# EAGLE design SmellSprayer (EAGLE 8.2.1)
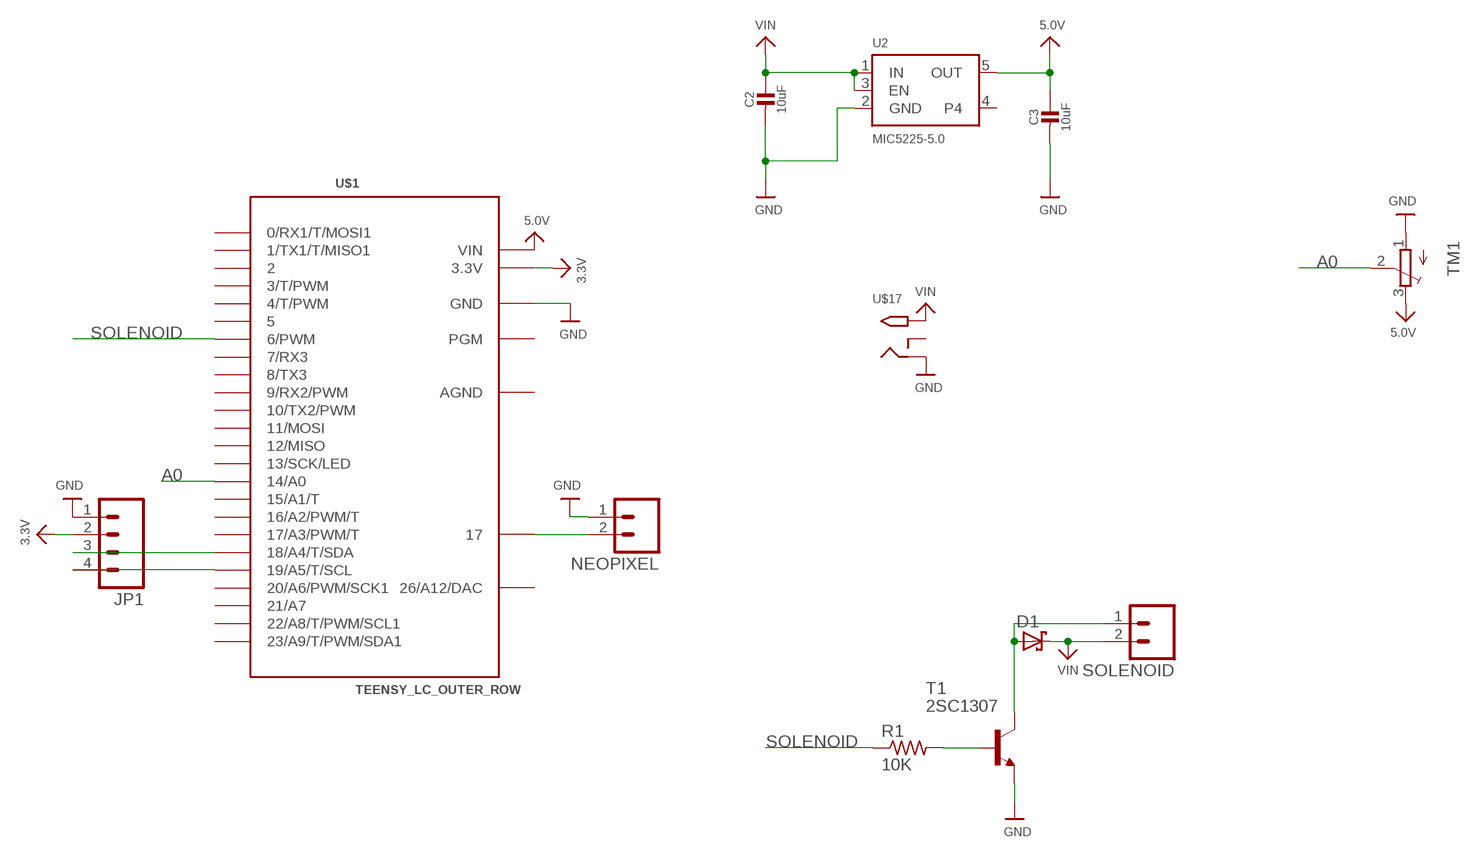
[diagram p0: schematic, sheet 1]

## Parts
C2  10uF  CAP_CERAMIC0805-NOOUTLINE  [0805-NO]
C3  10uF  CAP_CERAMIC0805-NOOUTLINE  [0805-NO]
D1  SCHOTTKY-DIODEDO41-7  [DO41-7]
JP1  M04POLAR  [MOLEX-1X4]
NEOPIXEL  M02POLAR  [MOLEX-1X2]
R1  10K  R-US_R0805  [R0805]
SOLENOID  M023.5MM_LOCK  [SCREWTERMINAL-3.5MM-2_LOCK]
T1  2SC1307  [TO220AV]
TM1  TRIMPOT3386  [TRIM-3386]
U2  MIC5225-5.0  VREG_SOT23-5  [SOT23-5]
U$1  TEENSY_LC_OUTER_ROW  [TEENSY3-OUTER_ROW]
U$17  2.1MMJACKSMT  [DCJACK_2MM_SMT]

## Nets
3.3V: JP1.2 U$1.3.3V U$1.3.3V1(3.3V)
5.0V: C3.1 TM1.3(E) U2.5(OUT) U$1.VIN
A0: TM1.2(S) U$1.14/A0
GND: C2.2 C3.2 JP1.1 NEOPIXEL.1 T1.3(E) TM1.1(A) U2.2(GND) U$1.GND U$1.GND1(GND) U$17.GND(RING)
N$1: D1.A SOLENOID.1 T1.2(C)
N$2: R1.2 T1.1(B)
N$4: NEOPIXEL.2 U$1.VBAT
SCL: JP1.4 U$1.19/A5(19/A5/T/SCL)
SDA: JP1.3 U$1.18/A4(18/A4/T/SDA)
SOLENOID: R1.1 U$1.6(6/PWM)
VIN: C2.1 D1.C SOLENOID.2 U2.1(IN) U2.3(EN) U$17.PWR2(TIP)
Unconnected: U2.4 U$1.0(0/RX1/T/MOSI1) U$1.1(1/TX1/T/MISO1) U$1.2 U$1.3(3/T/PWM) U$1.4(4/T/PWM) U$1.5 U$1.7(7/RX3) U$1.8(8/TX3) U$1.9(9/RX2/PWM) U$1.10(10/TX2/PWM) U$1.11(11/MOSI) U$1.12(12/MISO) U$1.13(13/SCK/LED) U$1.15/A1(15/A1/T) U$1.16/A2(16/A2/PWM/T) U$1.17/A3(17/A3/PWM/T) U$1.20/A6(20/A6/PWM/SCK1) U$1.21/A7 U$1.22/A8(22/A8/T/PWM/SCL1) U$1.23/A9(23/A9/T/PWM/SDA1) U$1.PGM U$17.GNDBREAK(RING_SW)

## Power pins joined to a net without a drawn wire
26/A12/DAC: U$1.RESET/DAC(26/A12/DAC)
AGND: U$1.AGND

## Library data of the parts
C2 C3 = microbuilder:CAP_CERAMIC: Ceramic Capacitors For new designs, use the packages preceded by an '_' character since they are more reliable: The following footprints should be used on most boards: _0402 - Standard footprint for regular board layouts _0603 - Standard footprint for regular board layouts _0805 - Standard footprint for regular board layouts _1206 - Standard footprint for regular board layouts For extremely tight-pitch boards where space is at a premium, the following 'micro-pitch' footprints can be used (smaller pads, no silkscreen outline, etc.): _0402MP - Micro-pitch footprint for very dense/compact boards _0603MP - Micro-pitch footprint for very dense/compact boards _0805MP - Micro-pitch footprint for very dense/compact boards _1206MP - Micro-pitch footprint for very dense/compact boards
D1 = adafruit:SCHOTTKY-DIODE: Schottky Diode
JP1 = SparkFun-Connectors:M04: Header 4 Standard 4-pin 0.1" header. Use with straight break away headers (SKU : PRT-00116), right angle break away headers (PRT-00553), swiss pins (PRT-00743), machine pins (PRT-00117), and female headers (PRT-00115). Molex polarized connector foot print use with SKU : PRT-08231 with associated crimp pins and housings. 1MM SMD Version SKU: PRT-10208
NEOPIXEL = SparkFun-Connectors:M02: Standard 2-pin 0.1" header. Use with - straight break away headers ( PRT-00116) - right angle break away headers (PRT-00553) - swiss pins (PRT-00743) - machine pins (PRT-00117) - female headers (PRT-00115) Molex polarized connector foot print use with: PRT-08233 with associated crimp pins and housings. 2.54_SCREWTERM for use with PRT-10571. 3.5mm Screw Terminal footprints for PRT-08084 5mm Screw Terminal footprints for use with PRT-08432
R1 = adafruit:R-US_: RESISTOR, American symbol
SOLENOID = SparkFun-Connectors:M02: Standard 2-pin 0.1" header. Use with - straight break away headers ( PRT-00116) - right angle break away headers (PRT-00553) - swiss pins (PRT-00743) - machine pins (PRT-00117) - female headers (PRT-00115) Molex polarized connector foot print use with: PRT-08233 with associated crimp pins and housings. 2.54_SCREWTERM for use with PRT-10571. 3.5mm Screw Terminal footprints for PRT-08084 5mm Screw Terminal footprints for use with PRT-08432; PROD_ID: CONN-08399
T1 = transistor:2SC1307: NPN Transistor Silicon Epitaxial, High Frequency Power Amplifier Source: 2SC1307.pdf
TM1 = adafruit:TRIMPOT: SMT trimmer potentiometer part number TC33X http://www.ladyada.net/library/eagle
U2 = microbuilder:VREG_SOT23-5: SOT23-5 Fixed Voltage Regulators Part Current Out V Out V In V Dropout θJA (°C/W) TJ (°C) Digikey Part No. ADP121 150mA 3.3V 3.4-5.5V 0.09V @ 150mA -- -- ADP121-AUJZ33R7CT-ND ADP121 150mA 3.0V 3.1-5.5V 0.09V @ 150mA -- -- ADP121-AUJZ30R7CT-ND ADP122 300mA 3.3V 3.4-5.5V 0.085V @ 300mA -- -- ADP122AUJZ-3.3-R7CT-ND ADP1712 300mA 3.3V 3.5-5.5V 0.17V @ 300mA -- -- ADP1712AUJZ-3.3-R7TR-ND AP7311 (Low Cost) 150mA 3.3V 3.5-6V 0.15V @ 150mA -- -- AP7311-33WG-7DICT-ND LD39015M18R 150mA 1.8V 1.9V-5.5V 0.08V @ 100mA -- -- 497-6977-1-ND LP2985A-33DBVR 150mA 3.3V 3.3-16V 0.28V @ 150mA 206 150 296-18479-1-ND MCP1824T-3302E/OT 300mA 3.3V 3.5V-6V 0.2V @ 300mA -- -- MCP1824T-3302E/OTCT-ND MIC5205-2.5YM5 TR 150mA 2.5V 2.7-16V 0.165V @ 150mA -- -- 576-1257-2-ND MIC5205-3.0YM5 TR 150mA 3.0V 3.2V-16V 0.165V @ 150mA -- -- 576-1258-2-ND MIC5205-3.3YM5 TR 150mA 3.3V 3.5V-16V 0.165V @ 150mA -- -- 576-1259-2-ND TPS780330220 150mA 3.3V+2.2V 3.6-5.5V 250mV Max -- -- 296-23332-1-ND TDA3663/N1,135 100mA 3.3V 3.5-45V 0.18V @ 50mA -- -- 568-5343-1-ND Max operating temp can be calculated using θJA, TJ (max junction temperature), and power in watts. Set the "Maximum Ambient Temperature" until it reaches TJ ("Max Junction Temperature"), which is the absolute limit for safe use of the regulator: Heat Sink Temperature Calculator <http://www.daycounter.com/Calculators/Heat-Sink-Temperature-Calculator.phtml> For example, With 12V source into a 3.3V LP2985 and a 30mA load, we are dissipating (12V-3.3V) * 0.03A = 0.261W. With a θJA of 206 °C/W, a TJ of 150°C, and 261mW we can safely use the chip without a heat sink up to 75°C (=147.1°C Junction Temperature).
U$1 = Teensy_3_and_LC_Series_Boards_v1.0:TEENSY_LC_OUTER_ROW: Teensy LC with only outer row of pins.
U$17 = adafruit:2.1MMJACK: 2.1mm x 5.5mm THM DC jack with internal switch. Digikey part #PJ-102A, 4UCON part #05537 2.1mm x 5.5mm SMT DC jack with internal switch. Digikey part #PJ-002A-SMT, 4UCON part #03267 By microbuilder.eu & adafruit.com

## Board
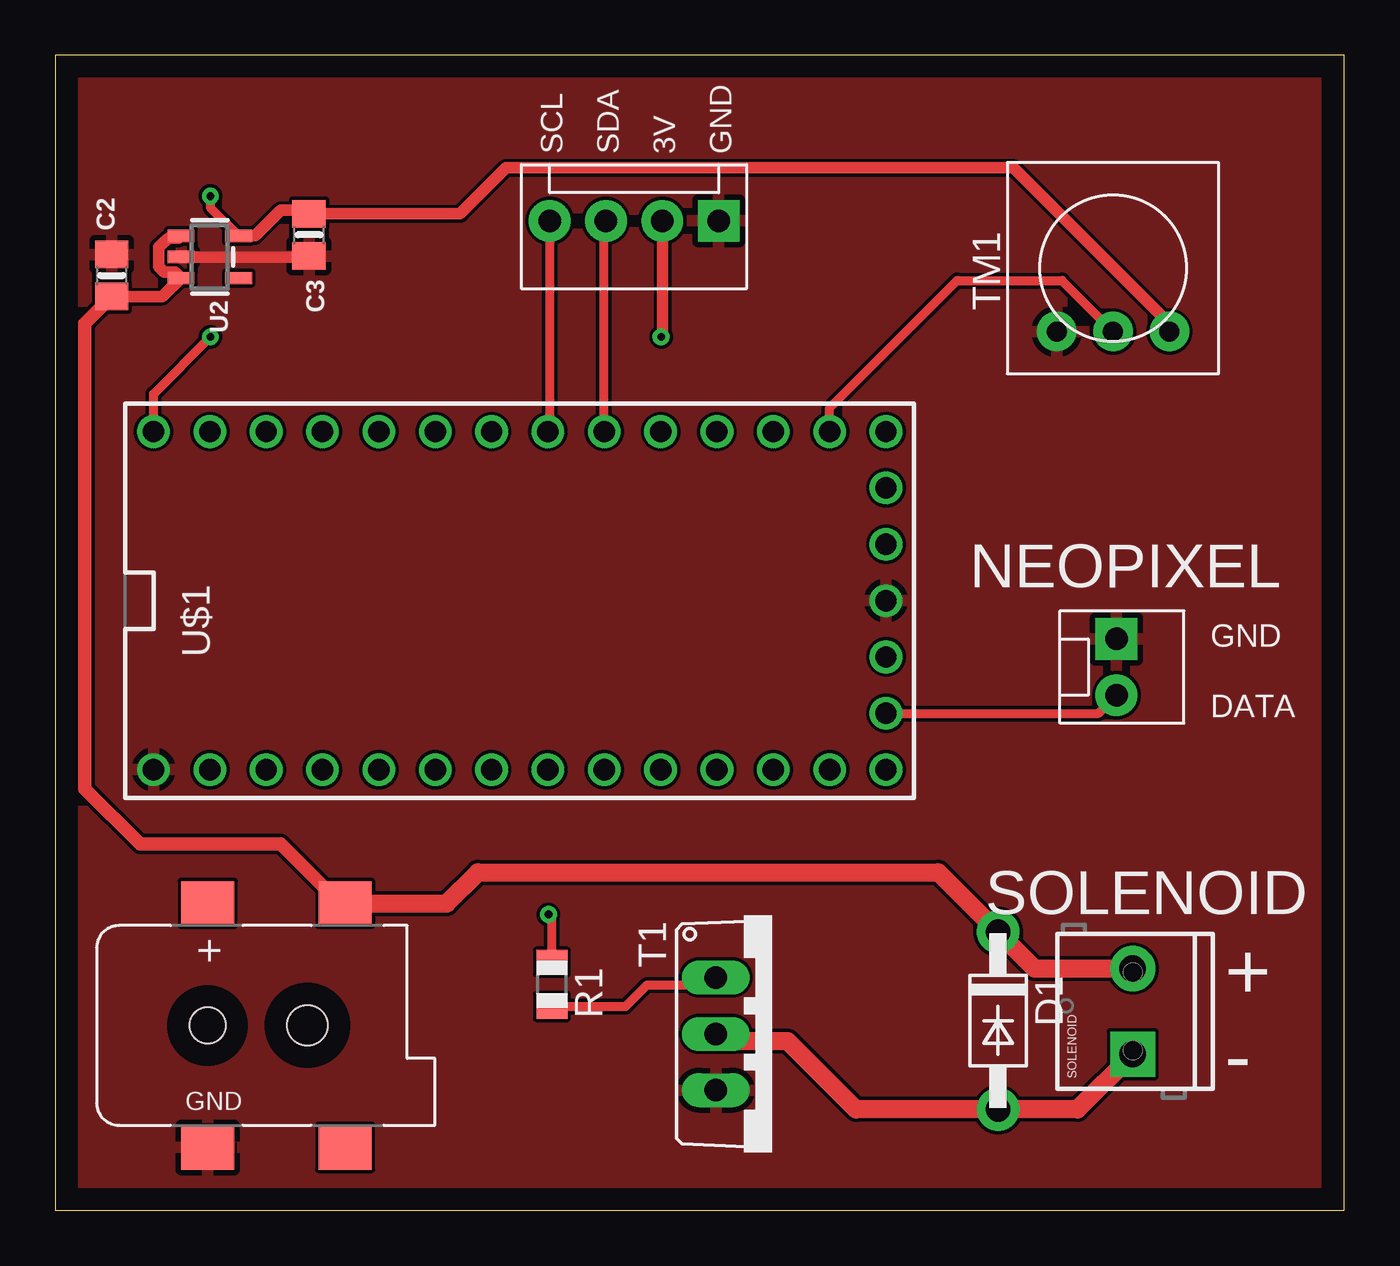
[diagram p1: board, top side]
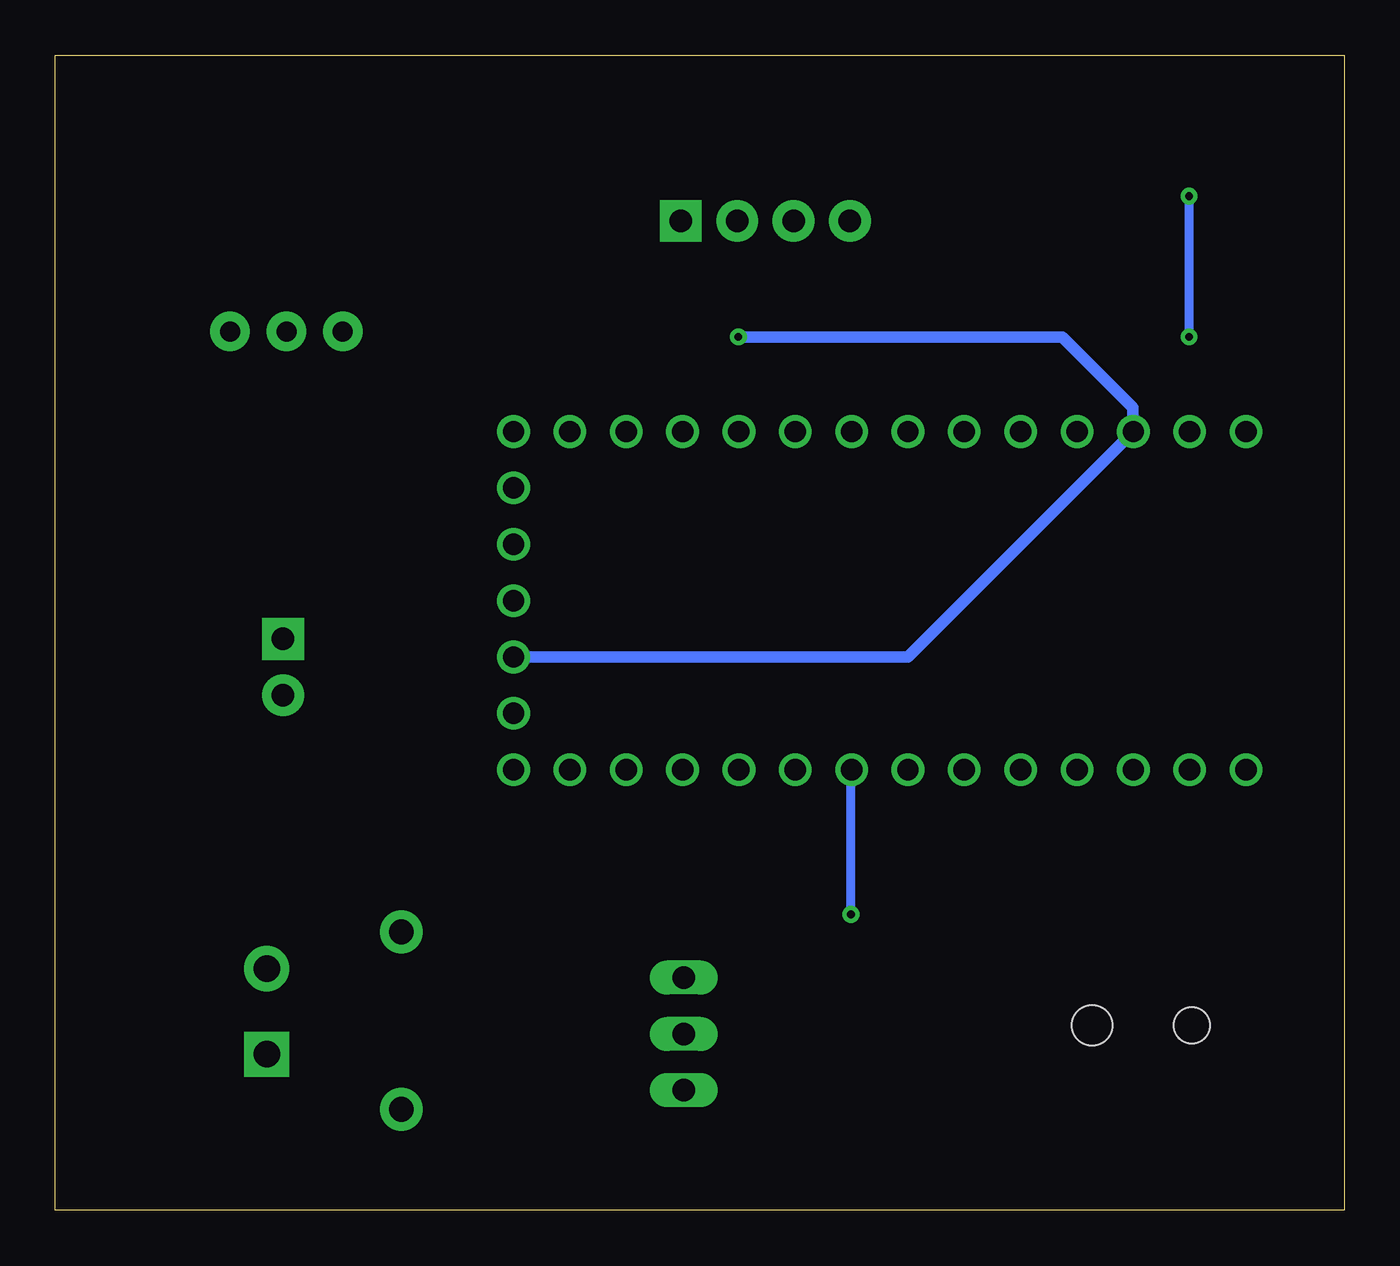
[diagram p2: board, bottom side, seen from below]

Size 58.09 x 52.06 mm. Coordinates in mm from the lower left corner, seen from the top.
Outline: 0,0 58.09,0 58.09,52.06 0,52.06 0,0
Copper layers (1*16): Top 0.035mm / dielectric 1.5mm / Bottom 0.035mm
Design rules "default": minimum track width 6mil, minimum drill 0.35mm, track to track 6mil, track to pad 6mil, pad to pad 6mil, via to via 6mil, smd to smd 6mil, copper to edge 40mil, drill to drill 6mil, minimum pad ring 10mil, minimum via ring 8mil, stop-mask expansion 4mil, vias tented up to drill 0mil, thermal gap 10mil

### Footprints (pad centres in the part's own frame; a part is rotated, then mirrored left to right if it is on the bottom)
0805-NO = smd 1.24 x 1.5: 1 -0.95,0; 2 0.95,0
DO41-7 = drill 1.118 pad 1.93: A 4,0; C -4,0
MOLEX-1X4 = drill 1.016 pad 1.88 square: 1 0,0 | drill 1.016 pad 1.88: 2 2.54,0; 3 5.08,0; 4 7.62,0
MOLEX-1X2 = drill 1.016 pad 1.88 square: 1 0,0 | drill 1.016 pad 1.88: 2 2.54,0
R0805 = smd 1.1 x 1.4: 1 -1,0; 2 1,0
SCREWTERMINAL-3.5MM-2_LOCK = drill 1.2 pad 2.032 square: 1 -0.178,0 | drill 1.2 pad 2.032: 2 3.678,0
TO220AV = drill 1.016 long: 1 -2.54,-2.54; 2 0,-2.54; 3 2.54,-2.54
TRIM-3386 = drill 0.9 pad 1.778: 1 -2.54,-2.857; 2 0,-2.857; 3 2.54,-2.857
SOT23-5 = smd 0.55 x 1.2: 1 -0.95,-1.3; 2 0,-1.3; 3 0.95,-1.3; 4 0.95,1.3; 5 -0.95,1.3
TEENSY3-OUTER_ROW = drill 0.965: 0 -7.62,13.97; 1 -7.62,11.43; 2 -7.62,8.89; 3 -7.62,6.35; 3.3V 7.62,11.43; 3.3V1 -2.54,-16.51; 4 -7.62,3.81; 5 -7.62,1.27; 6 -7.62,-1.27; 7 -7.62,-3.81; 8 -7.62,-6.35; 9 -7.62,-8.89; 10 -7.62,-11.43; 11 -7.62,-13.97; 12 -7.62,-16.51; 13 7.62,-16.51; 14/A0 7.62,-13.97; 15/A1 7.62,-11.43; 16/A2 7.62,-8.89; 17/A3 7.62,-6.35; 18/A4 7.62,-3.81; 19/A5 7.62,-1.27; 20/A6 7.62,1.27; 21/A7 7.62,3.81; 22/A8 7.62,6.35; 23/A9 7.62,8.89; AGND 7.62,13.97; GND -7.62,16.51; GND1 0,-16.51; PGM 2.54,-16.51; RESET/DAC 5.08,-16.51; VBAT -5.08,-16.51; VIN 7.62,16.51
DCJACK_2MM_SMT = smd 2.4 x 2: GND 0,-5.5; GNDBREAK 6.2,-5.5; PWR1 0,5.5; PWR2 6.2,5.5 | hole 1.6: 0,0 | hole 1.8: 4.5,0

### Placement (x,y rotation side)
C2  2.54,42.14 90 top
C3  11.43,43.97 270 top
D1  42.49,8.55 270 top
JP1  29.9,44.6 180 top
NEOPIXEL  47.83,25.76 270 top
R1  22.38,10.19 270 top
SOLENOID  48.56,7.21 90 top
T1  32.31,7.95 270 top
TM1  47.68,42.47 0 top
U2  6.96,42.98 270 top
U$1  20.93,27.48 90 top
U$17  6.86,8.33 0 top

### Tracks (layer width: path | path; a pad name or v marks a point on that pad's centre or on a via)
3.3V  (via drill 0.35 pad 0.55)
  Top 0.508: JP1.2 27.36,39.42 v27.3,39.37
  Bottom 0.508: v27.3,39.37 12.7,39.37 9.53,36.2 9.53,35.13 U$1.3.3V 19.66,24.94 U$1.3.3V1
5.0V  (via drill 0.35 pad 0.55)
  Top 0.406: U$1.VIN 4.42,36.8 v6.99,39.37 | v6.99,45.72 6.99,45.2 U2.5
  Top 0.508: U2.5 9,43.93 10.16,45.09 11.27,45.09 C3.1 18.25,44.92 20.32,46.99 43.18,46.99 50.16,40.01 50.16,39.66 TM1.3
  Bottom 0.406: v6.99,39.37 v6.99,45.72
A0
  Top 0.406: U$1.14/A0 34.9,36.17 40.64,41.91 45.38,41.91 TM1.2
GND
  Top 0.508: U2.2 11.39,42.98 C3.2
  pour Top: -3.81,53.98 60.33,53.98 60.33,-1.91 -3.81,-1.91
N$1
  Top 0.813: SOLENOID.1 46.08,4.55 D1.A 36.09,4.55 33.02,7.62 30.1,7.62 T1.2
N$2
  Top 0.406: R1.2 25.7,9.19 26.67,10.16 29.44,10.16 T1.1
N$4
  Top 0.406: U$1.VBAT 47.02,22.4 NEOPIXEL.2
SCL
  Top 0.406: JP1.4 22.28,35.18 U$1.19/A5
SDA
  Top 0.406: U$1.18/A4 24.74,44.53 JP1.3
SOLENOID  (via drill 0.35 pad 0.55)
  Top 0.406: R1.1 22.38,13.18 v22.23,13.34
  Bottom 0.406: v22.23,13.34 22.23,19.84 U$1.6
VIN
  Top 0.508: C2.1 4.82,41.19 U2.3 5.39,42.3 4.89,42.3 4.65,42.53 4.65,43.42 4.89,43.66 4.92,43.66 5.08,43.81 5.55,43.81 U2.1
  Top 0.61: U$17.PWR2 12.84,13.83 10.16,16.51 3.81,16.51 1.32,19 1.32,39.97 C2.1
  Top 0.813: U$17.PWR2 17.64,13.83 19.05,15.24 39.8,15.24 D1.C 44.15,10.89 SOLENOID.2

### Text on the board
tPlace: SCL | SDA | 3V | GND | NEOPIXEL | GND | DATA | SOLENOID | + | -